# Altium schematic sheet RTL8153B_DemoSCH.schdoc
size 253 x 166 mm
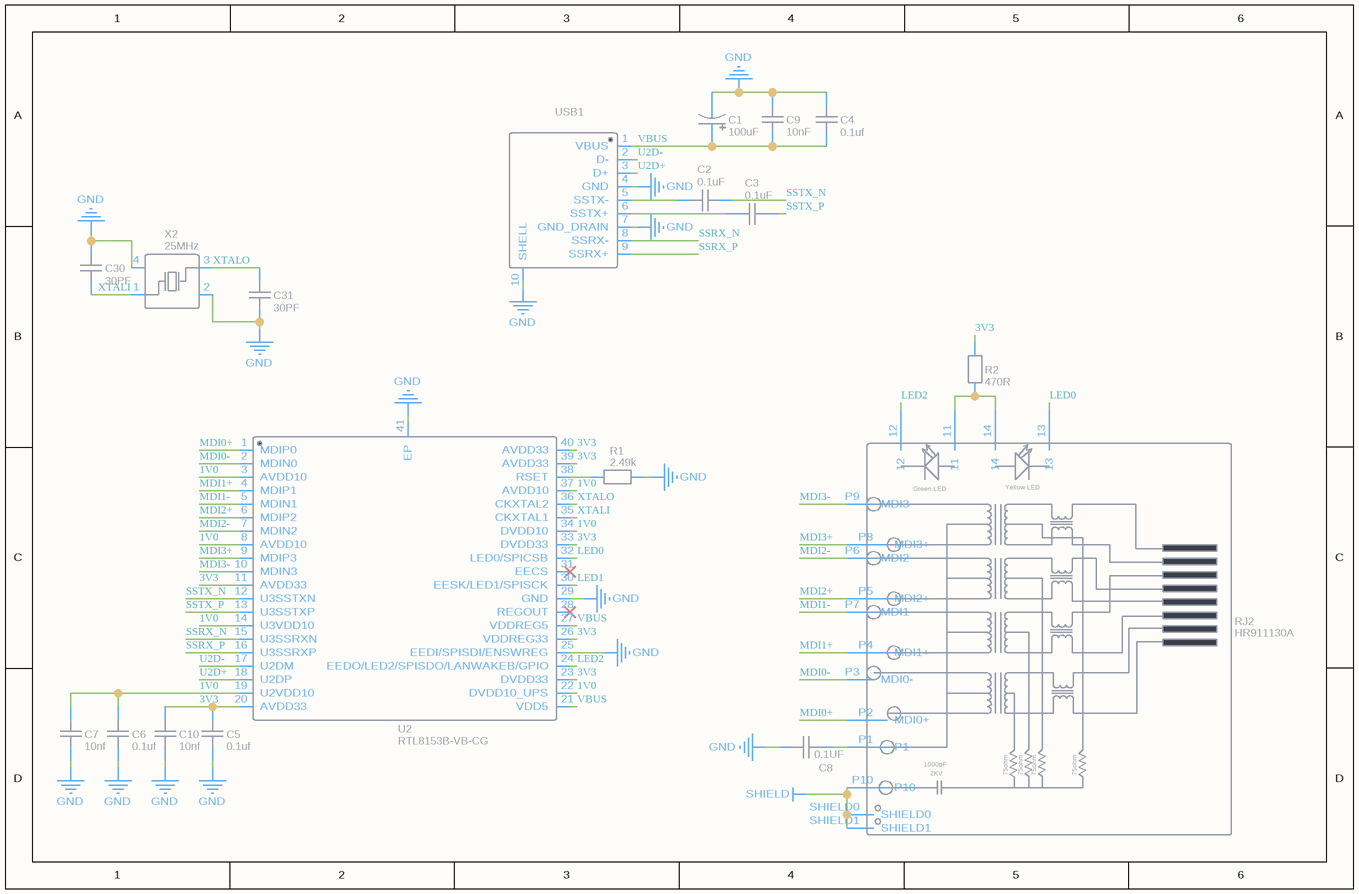
[diagram p0: RTL8153B_DemoSCH.schdoc]

## Parts
C1  100uF  [CAP-SMD_BD6.3-L6.6-W6.6-FD]
C2  0.1uF  [C0402_NEW]
C3  0.1uF  [C0402_NEW]
C4  0.1uf  [C0402_NEW]
C5  0.1uf  [C0402_NEW]
C6  0.1uf  [C0402_NEW]
C7  10nf  [C0402_NEW]
C8  0.1UF  [C0402_NEW]
C9  10nF  [C0402_NEW]
C10  10nf  [C0402_NEW]
C30  30PF  [C0402_NEW]
C31  30PF  [C0402_NEW]
R1  2.49k  [R0603_NEW]
R2  470R  [C0402_NEW]
RJ2  HR911130A  [RJ45-TH_HR911130A]
U2  RTL8153B-VB-CG  [QFN-40_L5.0-W5.0-P0.40-BL-EP3.7]
USB1  U3B22D-09BM4YN22HF  [USB3.0-B-TH_U235-091N-4BLRC16-2-5]  (value not drawn)
X2  25MHz  [OSC-SMD_4P-L3.2-W2.5-BL]

## Nets
GND: C1.2 C4.2 C5.1 C6.1 C7.1 C8.1 C9.1 C10.1 C30.2 C31.1 R1.2 U2.25(EEDI/SPISDI/ENSWREG) U2.29(GND) U2.41(EP) USB1.4(GND) USB1.7(GND_DRAIN) USB1.10(SHELL) X2.2(GND) X2.4(GND)
SHIELD: RJ2.P10 RJ2.SHIELD0 RJ2.SHIELD1
1V0: C6.2 C7.2 U2.3(AVDD10) U2.8(AVDD10) U2.14(U3VDD10) U2.19(U2VDD10) U2.22(DVDD10_UPS) U2.34(DVDD10) U2.37(AVDD10)
3V3: C5.2 C10.2 R2.2 U2.11(AVDD33) U2.20(AVDD33) U2.23(DVDD33) U2.26(VDDREG33) U2.33(DVDD33) U2.39(AVDD33) U2.40(AVDD33)
LED0: RJ2.13 U2.32(LED0/SPICSB)
LED1: U2.30(EESK/LED1/SPISCK)
LED2: RJ2.12 U2.24(EEDO/LED2/SPISDO/LANWAKEB/GPIO)
MDI0+: RJ2.P2(MDI0+) U2.1(MDIP0)
MDI0-: RJ2.P3(MDI0-) U2.2(MDIN0)
MDI1+: RJ2.P4(MDI1+) U2.4(MDIP1)
MDI1-: RJ2.P7(MDI1-) U2.5(MDIN1)
MDI2+: RJ2.P5(MDI2+) U2.6(MDIP2)
MDI2-: RJ2.P6(MDI2-) U2.7(MDIN2)
MDI3+: RJ2.P8(MDI3+) U2.9(MDIP3)
MDI3-: RJ2.P9(MDI3-) U2.10(MDIN3)
SSRX_N: U2.15(U3SSRXN) USB1.8(SSRX-)
SSRX_P: U2.16(U3SSRXP) USB1.9(SSRX+)
SSTX_N: C2.2 U2.12(U3SSTXN)
SSTX_P: C3.2 U2.13(U3SSTXP)
U2D+: U2.18(U2DP) USB1.3(D+)
U2D-: U2.17(U2DM) USB1.2(D-)
VBUS: C1.1 C4.1 C9.2 U2.21(VDD5) U2.27(VDDREG5) USB1.1(VBUS)
XTALI: C30.1 U2.35(CKXTAL1) X2.1(OSC1)
XTALO: C31.2 U2.36(CKXTAL2) X2.3(OSC2)
NetC2_1: C2.1 USB1.5(SSTX-)
NetC3_1: C3.1 USB1.6(SSTX+)
NetC8_2: C8.2 RJ2.P1
NetR1_1: R1.1 U2.38(RSET)
NetR2_1: R2.1 RJ2.11 RJ2.14

Not connected (* = marked no-connect by the designer): U2 28(REGOUT)* 31(EECS)*

## Notes on the sheet
- (in symbol HR911130A) Yellow LED; Green LED; J8; J7; J6 RX-; J5; J4; J3 RX+; J2 TX-; J1 TX+; 1000pF; 75ohm; 2KV

## Library data of the parts
C1 = 100uF: BOM_Manufacturer: SamYoung Electronics; BOM_Manufacturer Part: MVK16VC100M6.3*5_6.3TP; nameAlias: Capacitance; Contributor: LCSC; BOM_Supplier: LCSC; BOM_Supplier Part: C346929; spicePre: C; spiceSymbolName: MVK16VC100M6.3*5_6.3TP
C2 C3 = 0.1uF: nameAlias: Value(F); Contributor: LCEDA_Lib; spicePre: C; spiceSymbolName: C_0201_US
C4-C6 = 0.1uf: nameAlias: Value(F); Contributor: LCEDA_Lib; spicePre: C; spiceSymbolName: C_0603_US
C7 C10 = 10nf: nameAlias: Value(F); Contributor: LCEDA_Lib; spicePre: C; spiceSymbolName: C_0603_US
C8 = 0.1UF: nameAlias: Value(F); Contributor: LCEDA_Lib; spicePre: C; spiceSymbolName: C_0201_US
C9 = 10nF: nameAlias: Value(F); Contributor: LCEDA_Lib; spicePre: C; spiceSymbolName: C_0201_US
C30 C31 = 30PF: nameAlias: Value(F); Contributor: LCEDA_Lib; spicePre: C; spiceSymbolName: C_0603_US
R1 = 2.49k: nameAlias: Value(Ω); Contributor: LCEDA_Lib; spicePre: R; spiceSymbolName: R_0603_EU
R2 = 470R: nameAlias: Value(Ω); Contributor: LCEDA_Lib; spicePre: R; spiceSymbolName: R_0603_EU
RJ2 = HR911130A: BOM_Manufacturer: HANRUN; BOM_Supplier: LCSC; BOM_Manufacturer Part: HR911130A; BOM_Supplier Part: C54408; spicePre: R; spiceSymbolName: HR911130A
U2 = RTL8153B-VB-CG: BOM_Manufacturer: REALTEK(瑞昱); Contributor: LCSC; BOM_Supplier: LCSC; BOM_Supplier Part: C2802072; BOM_Manufacturer Part: RTL8153B-VB-CG; BOM_JLCPCB Part Class: Extended Part; spicePre: U; spiceSymbolName: RTL8153B-VB-CG
USB1 = U3B22D-09BM4YN22HF: BOM_Manufacturer: DLK(德力康); Contributor: LCSC; BOM_Supplier: LCSC; BOM_Supplier Part: C717655; BOM_Manufacturer Part: U3B22D-09BM4YN22HF; BOM_JLCPCB Part Class: Extended Part; spicePre: U; spiceSymbolName: U3B22D-09BM4YN22HF
X2 = 25MHz: BOM_Manufacturer: Zhejiang Abel Elec; BOM_Manufacturer Part: SMD-3225_4P25MHZ12PF10PPM-40~+85℃; nameAlias: Frequency; Contributor: LCSC; SMT Type: Extend; BOM_Supplier: LCSC; BOM_Supplier Part: C164047; BOM_LCSC Assembly: Yes; spicePre: X; spiceSymbolName: SMD-3225_4P25MHZ12PF10PPM-40~+85℃